# Altium project Master.PrjPcb
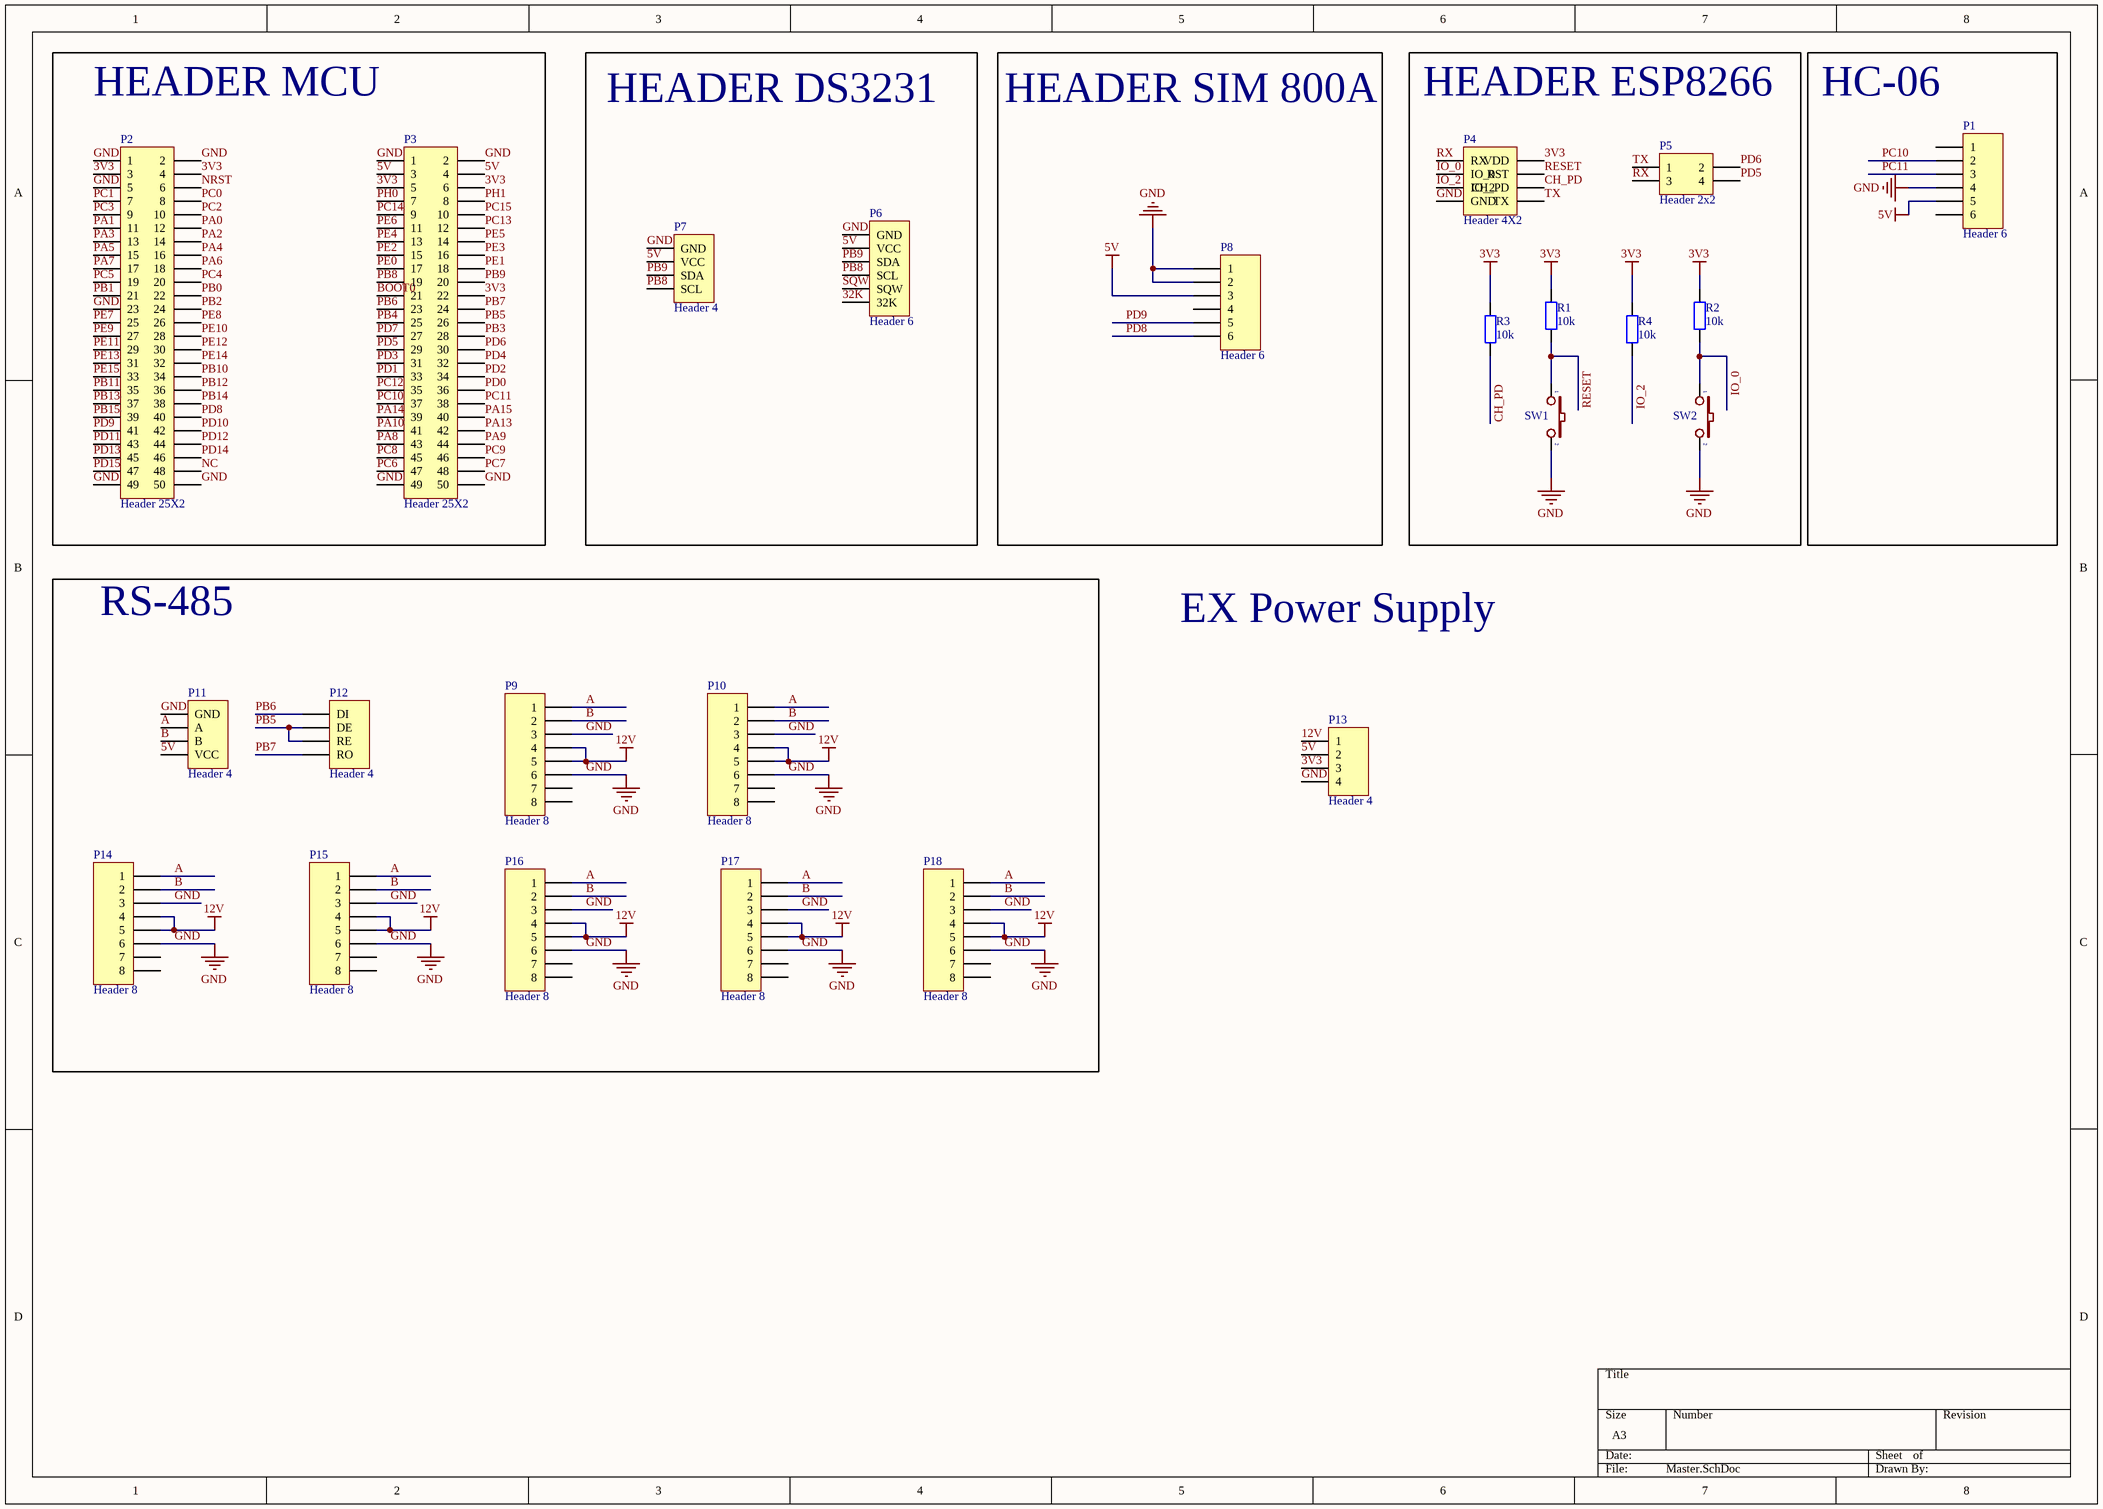
[diagram p0: Master.SchDoc]
1 sheet, 24 parts. Net scope: global (net labels, ports and power ports of the same name join across sheets).
Board file: Master.PcbDoc

## Sheet Master.SchDoc
size A3

### Parts
P1  Header 6  [HDR1X6]
P2  Header 25X2  [HDR2X25]
P3  Header 25X2  [HDR2X25]
P4  Header 4X2  [HDR2X4]
P5  Header 2x2  [Header 2x2]
P6  Header 6  [HDR1X6]
P7  Header 4  [HDR1X4]
P8  Header 6  [HDR1X6]
P9  Header 8  [RJ11]
P10  Header 8  [RJ11]
P11  Header 4  [HDR1X4]
P12  Header 4  [HDR1X4]
P13  Header 4  [Header 4]
P14  Header 8  [RJ11]
P15  Header 8  [RJ11]
P16  Header 8  [RJ11]
P17  Header 8  [RJ11]
P18  Header 8  [RJ11]
R1  value 10k  [R1/4W]  (hidden comment: RES_SMD_0805)
R2  value 10k  [R1/4W]  (hidden comment: RES_SMD_0805)
R3  value 10k  [R1/4W]  (hidden comment: RES_SMD_0805)
R4  value 10k  [R1/4W]  (hidden comment: RES_SMD_0805)
SW1  SW  [SW-SMD]  (value not drawn)
SW2  SW  [SW-SMD]  (value not drawn)

### Blocks framed on the sheet
HEADER MCU: P2 P3
HEADER DS3231: P6 P7
HEADER SIM 800A: P8
HEADER ESP8266: P4 P5 R1-R4 SW1 SW2
HC-06: P1
RS-485: P9-P12 P14-P18

### Nets
3V3: P2.3 P2.4 P3.5 P3.6 P3.22 P4.2(VDD) P13.3 R1.1 R2.1 R3.1 R4.1
5V: P1.5 P3.3 P3.4 P6.2(VCC) P7.2(VCC) P8.3 P11.4(VCC) P13.2
12V: P9.4 P9.5 P10.4 P10.5 P13.1 P14.4 P14.5 P15.4 P15.5 P16.4 P16.5 P17.4 P17.5 P18.4 P18.5
GND: P1.4 P2.1 P2.2 P2.5 P2.23 P2.49 P2.50 P3.1 P3.2 P3.49 P3.50 P4.7(GND) P6.1(GND) P7.1(GND) P8.1 P8.2 P9.3 P9.6 P10.3 P10.6 P11.1(GND) P13.4 P14.3 P14.6 P15.3 P15.6 P16.3 P16.6 P17.3 P17.6 P18.3 P18.6 SW1.2 SW2.2
32K: P6.6(32K)
A: P9.1 P10.1 P11.2(A) P14.1 P15.1 P16.1 P17.1 P18.1
B: P9.2 P10.2 P11.3(B) P14.2 P15.2 P16.2 P17.2 P18.2
BOOT0: P3.21
CH_PD: P4.6(CH_PD) R3.2
IO_0: P4.3(IO_0) R2.2 SW2.1
IO_2: P4.5(IO_2) R4.2
NC: P2.48
NRST: P2.6
PA0: P2.12
PA1: P2.11
PA2: P2.14
PA3: P2.13
PA4: P2.16
PA5: P2.15
PA6: P2.18
PA7: P2.17
PA8: P3.43
PA9: P3.44
PA10: P3.41
PA13: P3.42
PA14: P3.39
PA15: P3.40
PB0: P2.22
PB1: P2.21
PB2: P2.24
PB3: P3.28
PB4: P3.25
PB5: P3.26 P12.2(DE) P12.3(RE)
PB6: P3.23 P12.1(DI)
PB7: P3.24 P12.4(RO)
PB8: P3.19 P6.4(SCL) P7.4(SCL)
PB9: P3.20 P6.3(SDA) P7.3(SDA)
PB10: P2.34
PB11: P2.35
PB12: P2.36
PB13: P2.37
PB14: P2.38
PB15: P2.39
PC0: P2.8
PC1: P2.7
PC2: P2.10
PC3: P2.9
PC4: P2.20
PC5: P2.19
PC6: P3.47
PC7: P3.48
PC8: P3.45
PC9: P3.46
PC10: P1.2 P3.37
PC11: P1.3 P3.38
PC12: P3.35
PC13: P3.12
PC14: P3.9
PC15: P3.10
PD0: P3.36
PD1: P3.33
PD2: P3.34
PD3: P3.31
PD4: P3.32
PD5: P3.29 P5.4
PD6: P3.30 P5.2
PD7: P3.27
PD8: P2.40 P8.6
PD9: P2.41 P8.5
PD10: P2.42
PD11: P2.43
PD12: P2.44
PD13: P2.45
PD14: P2.46
PD15: P2.47
PE0: P3.17
PE1: P3.18
PE2: P3.15
PE3: P3.16
PE4: P3.13
PE5: P3.14
PE6: P3.11
PE7: P2.25
PE8: P2.26
PE9: P2.27
PE10: P2.28
PE11: P2.29
PE12: P2.30
PE13: P2.31
PE14: P2.32
PE15: P2.33
PH0: P3.7
PH1: P3.8
RESET: P4.4(RST) R1.2 SW1.1
RX: P4.1(RX) P5.3
SQW: P6.5(SQW)
TX: P4.8(TX) P5.1

Not connected (* = marked no-connect by the designer): P1 1 6; P8 4; P9 7 8; P10 7 8; P14 7 8; P15 7 8; P16 7 8; P17 7 8; P18 7 8

### Notes on the sheet
- EX Power Supply

### Library data of the parts
P1 P6 P8 = Header 6: Header, 6-Pin; LatestRevisionDate: 17-Jul-2002; LatestRevisionNote: Re-released for DXP Platform.; Publisher: Altium Limited
P2 P3 = Header 25X2: Header, 25-Pin, Dual row; LatestRevisionDate: 17-Jul-2002; LatestRevisionNote: Re-released for DXP Platform.; Publisher: Altium Limited
P4 = Header 4X2: Header, 4-Pin, Dual row; LatestRevisionDate: 17-Jul-2002; LatestRevisionNote: Re-released for DXP Platform.; Publisher: Altium Limited
P5 = Header 2x2: Header, 4-Pin, 2-Row; LatestRevisionDate: 17-Jul-2002; LatestRevisionNote: Re-released for DXP Platform.; Publisher: Altium Limited
P7 P11-P13 = Header 4: Header, 4-Pin; LatestRevisionDate: 17-Jul-2002; LatestRevisionNote: Re-released for DXP Platform.; Publisher: Altium Limited
P9 P10 P14-P18 = Header 8: Header, 8-Pin; LatestRevisionDate: 17-Jul-2002; LatestRevisionNote: Re-released for DXP Platform.; Publisher: Altium Limited
R1-R4 = RES_SMD_0805: RES_0805; Published: 8-Jun-2000; LatestRevisionDate: 17-Jul-2002; LatestRevisionNote: Re-released for DXP Platform.; PackageReference: AXIAL-0.4; Publisher: Altium Limited
SW1 SW2 = SW2: Switch button 2 pin; Value: SW chip 2 pin